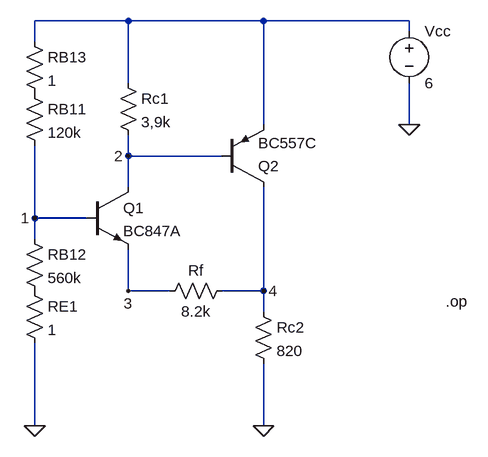
[diagram p0: schematic DC_equivalent_circuit(6V).asc]
DC_equivalent_circuit(6V).asc, the LTspice schematic file:
Version 4
SHEET 1 3200 680
WIRE 208 -64 64 -64
WIRE 416 -64 208 -64
WIRE 640 -64 416 -64
WIRE 640 -48 640 -64
WIRE 64 -32 64 -64
WIRE 208 32 208 -64
WIRE 416 96 416 -64
WIRE 640 96 640 32
WIRE 208 144 208 112
WIRE 352 144 208 144
WIRE 208 192 208 144
WIRE 64 240 64 128
WIRE 144 240 64 240
WIRE 64 272 64 240
WIRE 208 352 208 288
WIRE 272 352 208 352
WIRE 416 352 416 192
WIRE 416 352 352 352
WIRE 416 384 416 352
WIRE 64 560 64 432
WIRE 416 560 416 464
FLAG 640 96 0
FLAG 64 560 0
FLAG 416 560 0
FLAG 64 240 1
FLAG 208 144 2
FLAG 416 352 4
FLAG 208 352 3
SYMBOL res 48 -48 R0
SYMATTR InstName RB13
SYMATTR Value 1
SYMBOL res 48 32 R0
SYMATTR InstName RB11
SYMATTR Value 120k
SYMBOL res 48 256 R0
SYMATTR InstName RB12
SYMATTR Value 560k
SYMBOL res 48 336 R0
SYMATTR InstName RE1
SYMATTR Value 1
SYMBOL res 368 336 R90
WINDOW 0 0 56 VBottom 2
WINDOW 3 32 56 VTop 2
SYMATTR InstName Rf
SYMATTR Value 8.2k
SYMBOL res 400 368 R0
SYMATTR InstName Rc2
SYMATTR Value 820
SYMBOL voltage 640 -64 R0
WINDOW 123 0 0 Left 0
WINDOW 39 0 0 Left 0
SYMATTR InstName Vcc
SYMATTR Value 6
SYMBOL npn 144 192 R0
SYMATTR InstName Q1
SYMATTR Value BC847A
SYMBOL res 192 16 R0
SYMATTR InstName Rc1
SYMATTR Value 3,9k
SYMBOL pnp 352 192 M180
SYMATTR InstName Q2
SYMATTR Value BC557C
TEXT 696 368 Left 2 !.op

The netlist it stands for:
* DC_equivalent_circuit(6V).asc
RB13 N001 P001 1
RB11 P001 1 120k
RB12 1 P002 560k
RE1 P002 0 1
Rf 4 3 8.2k
Rc2 4 0 820
Vcc N001 0 6
Q1 2 1 3 0 BC847A
Rc1 N001 2 3,9k
Q2 4 2 N001 0 BC557C
.model NPN NPN
.model PNP PNP
.lib standard.bjt
.op
.backanno
.end